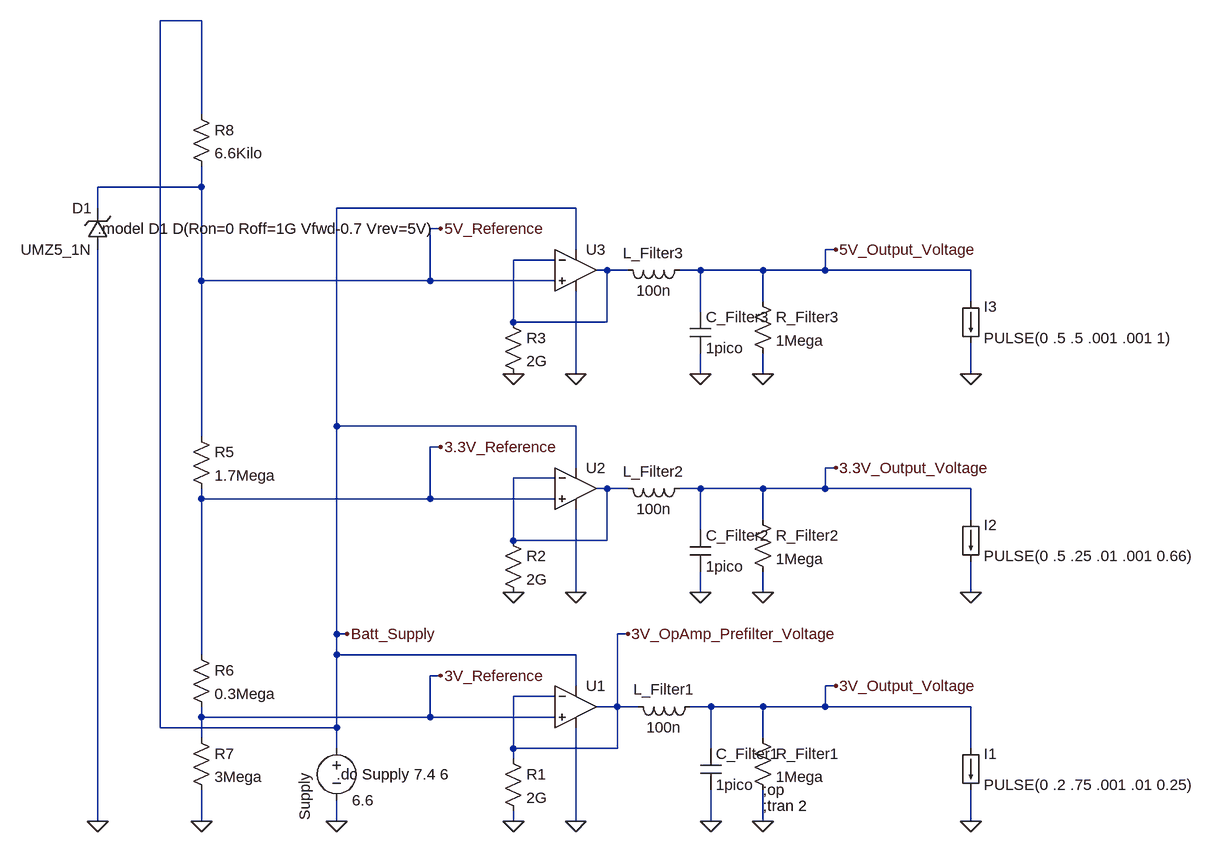
[diagram p0: schematic Cube Sat Power Supply.asc]
Cube Sat Power Supply.asc, the LTspice schematic file:
Version 4
SHEET 1 1560 680
WIRE 0 -992 -64 -992
WIRE 0 -848 0 -992
WIRE 0 -736 0 -768
WIRE 0 -736 -160 -736
WIRE -160 -704 -160 -736
WIRE 576 -704 208 -704
WIRE 368 -672 352 -672
WIRE 576 -640 576 -704
WIRE 976 -640 960 -640
WIRE 544 -624 480 -624
WIRE 624 -608 608 -608
WIRE 656 -608 624 -608
WIRE 768 -608 736 -608
WIRE 864 -608 768 -608
WIRE 960 -608 960 -640
WIRE 960 -608 864 -608
WIRE 1184 -608 960 -608
WIRE 0 -592 0 -736
WIRE 352 -592 352 -672
WIRE 352 -592 0 -592
WIRE 544 -592 352 -592
WIRE 864 -560 864 -608
WIRE 1184 -560 1184 -608
WIRE 768 -544 768 -608
WIRE 480 -528 480 -624
WIRE 624 -528 624 -608
WIRE 624 -528 480 -528
WIRE 576 -448 576 -576
WIRE 768 -448 768 -480
WIRE 864 -448 864 -480
WIRE 1184 -448 1184 -496
WIRE 208 -368 208 -704
WIRE 576 -368 208 -368
WIRE 0 -352 0 -592
WIRE 368 -336 352 -336
WIRE 576 -304 576 -368
WIRE 976 -304 960 -304
WIRE 544 -288 480 -288
WIRE 624 -272 608 -272
WIRE 656 -272 624 -272
WIRE 768 -272 736 -272
WIRE 864 -272 768 -272
WIRE 960 -272 960 -304
WIRE 960 -272 864 -272
WIRE 1184 -272 960 -272
WIRE 0 -256 0 -272
WIRE 352 -256 352 -336
WIRE 352 -256 0 -256
WIRE 544 -256 352 -256
WIRE 864 -224 864 -272
WIRE 1184 -224 1184 -272
WIRE 768 -208 768 -272
WIRE 480 -192 480 -288
WIRE 624 -192 624 -272
WIRE 624 -192 480 -192
WIRE 576 -112 576 -240
WIRE 768 -112 768 -144
WIRE 864 -112 864 -144
WIRE 1184 -112 1184 -160
WIRE 208 -48 208 -368
WIRE 224 -48 208 -48
WIRE 656 -48 640 -48
WIRE 0 -16 0 -256
WIRE 208 -16 208 -48
WIRE 576 -16 208 -16
WIRE 368 16 352 16
WIRE 576 32 576 -16
WIRE 976 32 960 32
WIRE 544 48 480 48
WIRE 640 64 640 -48
WIRE 640 64 608 64
WIRE 672 64 640 64
WIRE 784 64 752 64
WIRE 864 64 784 64
WIRE 960 64 960 32
WIRE 960 64 864 64
WIRE 1184 64 960 64
WIRE 0 80 0 64
WIRE 352 80 352 16
WIRE 352 80 0 80
WIRE 544 80 352 80
WIRE -64 96 -64 -992
WIRE 208 96 208 -16
WIRE 208 96 -64 96
WIRE 0 112 0 80
WIRE 864 112 864 64
WIRE 208 128 208 96
WIRE 480 128 480 48
WIRE 640 128 640 64
WIRE 640 128 480 128
WIRE 784 128 784 64
WIRE 1184 128 1184 64
WIRE 480 144 480 128
WIRE -160 240 -160 -640
WIRE 0 240 0 192
WIRE 208 240 208 208
WIRE 480 240 480 224
WIRE 576 240 576 96
WIRE 784 240 784 192
WIRE 864 240 864 192
WIRE 1184 240 1184 192
FLAG 208 240 0
FLAG 576 240 0
FLAG 480 240 0
FLAG 784 240 0
FLAG 864 240 0
FLAG 976 32 3V_Output_Voltage
FLAG 656 -48 3V_OpAmp_Prefilter_Voltage
FLAG 224 -48 Batt_Supply
FLAG 368 16 3V_Reference
FLAG 1184 240 0
FLAG 768 -448 0
FLAG 768 -112 0
FLAG 864 -112 0
FLAG 864 -448 0
FLAG 1184 -112 0
FLAG 1184 -448 0
FLAG 576 -448 0
FLAG 576 -112 0
FLAG 480 -448 0
FLAG 480 -112 0
FLAG 0 240 0
FLAG 368 -336 3.3V_Reference
FLAG 368 -672 5V_Reference
FLAG 976 -304 3.3V_Output_Voltage
FLAG 976 -640 5V_Output_Voltage
FLAG -160 240 0
SYMBOL voltage 208 112 R0
WINDOW 123 0 0 Left 0
WINDOW 39 0 0 Left 0
WINDOW 0 -49 127 VLeft 2
SYMATTR InstName Supply
SYMATTR Value 6.6
SYMBOL OpAmps\\UniversalOpAmp 576 64 R0
SYMATTR InstName U1
SYMBOL res 464 128 R0
SYMATTR InstName R1
SYMATTR Value 2G
SYMBOL ind 768 48 R90
WINDOW 0 5 56 VBottom 2
WINDOW 3 32 56 VTop 2
SYMATTR InstName L_Filter1
SYMATTR Value 100n
SYMBOL cap 768 128 R0
SYMATTR InstName C_Filter1
SYMATTR Value 1pico
SYMBOL res 848 96 R0
SYMATTR InstName R_Filter1
SYMATTR Value 1Mega
SYMBOL load 1168 128 R0
WINDOW 123 0 0 Left 0
WINDOW 39 0 0 Left 0
SYMATTR InstName I1
SYMATTR Value PULSE(0 .2 .75 .001 .01 0.25)
SYMBOL OpAmps\\UniversalOpAmp 576 -272 R0
SYMATTR InstName U2
SYMBOL OpAmps\\UniversalOpAmp 576 -608 R0
SYMATTR InstName U3
SYMBOL ind 752 -288 R90
WINDOW 0 5 56 VBottom 2
WINDOW 3 32 56 VTop 2
SYMATTR InstName L_Filter2
SYMATTR Value 100n
SYMBOL ind 752 -624 R90
WINDOW 0 5 56 VBottom 2
WINDOW 3 32 56 VTop 2
SYMATTR InstName L_Filter3
SYMATTR Value 100n
SYMBOL cap 752 -208 R0
SYMATTR InstName C_Filter2
SYMATTR Value 1pico
SYMBOL cap 752 -544 R0
SYMATTR InstName C_Filter3
SYMATTR Value 1pico
SYMBOL res 848 -576 R0
SYMATTR InstName R_Filter3
SYMATTR Value 1Mega
SYMBOL res 848 -240 R0
SYMATTR InstName R_Filter2
SYMATTR Value 1Mega
SYMBOL load 1168 -224 R0
WINDOW 123 0 0 Left 0
WINDOW 39 0 0 Left 0
SYMATTR InstName I2
SYMATTR Value PULSE(0 .5 .25 .01 .001 0.66)
SYMBOL load 1168 -560 R0
WINDOW 123 0 0 Left 0
WINDOW 39 0 0 Left 0
SYMATTR InstName I3
SYMATTR Value PULSE(0 .5 .5 .001 .001 1)
SYMBOL res 464 -208 R0
SYMATTR InstName R2
SYMATTR Value 2G
SYMBOL res 464 -544 R0
SYMATTR InstName R3
SYMATTR Value 2G
SYMBOL res -16 -368 R0
SYMATTR InstName R5
SYMATTR Value 1.7Mega
SYMBOL res -16 -32 R0
SYMATTR InstName R6
SYMATTR Value 0.3Mega
SYMBOL res -16 96 R0
SYMATTR InstName R7
SYMATTR Value 3Mega
SYMBOL res -16 -864 R0
SYMATTR InstName R8
SYMATTR Value 6.6Kilo
SYMBOL zener -144 -640 R180
WINDOW 0 24 64 Left 2
WINDOW 3 24 0 Left 2
SYMATTR InstName D1
SYMATTR Value UMZ5_1N
TEXT 864 192 Left 2 !;op
TEXT 864 216 Left 2 !;tran 2
TEXT -160 -672 Left 2 !.model D1 D(Ron=0 Roff=1G Vfwd-0.7 Vrev=5V)
TEXT 208 168 Left 2 !.dc Supply 7.4 6

The netlist it stands for:
* Cube Sat Power Supply.asc
V§Supply Batt_Supply 0 6.6
XU1 3V_Reference 3V_OpAmp_Prefilter_Voltage Batt_Supply 0 3V_OpAmp_Prefilter_Voltage level1 Avol=1Meg GBW=10Meg Vos=0 En=0 Enk=0 In=0 Ink=0 Rin=500Meg  ; pins In+ In- V+ V- OUT
R1 3V_OpAmp_Prefilter_Voltage 0 2G
L_Filter1 3V_Output_Voltage 3V_OpAmp_Prefilter_Voltage 100n
C_Filter1 3V_Output_Voltage 0 1pico
R_Filter1 3V_Output_Voltage 0 1Mega
I1 3V_Output_Voltage 0 PULSE(0 .2 .75 .001 .01 0.25)
XU2 3.3V_Reference N002 Batt_Supply 0 N002 level1 Avol=1Meg GBW=10Meg Vos=0 En=0 Enk=0 In=0 Ink=0 Rin=500Meg  ; pins In+ In- V+ V- OUT
XU3 5V_Reference N001 Batt_Supply 0 N001 level1 Avol=1Meg GBW=10Meg Vos=0 En=0 Enk=0 In=0 Ink=0 Rin=500Meg  ; pins In+ In- V+ V- OUT
L_Filter2 3.3V_Output_Voltage N002 100n
L_Filter3 5V_Output_Voltage N001 100n
C_Filter2 3.3V_Output_Voltage 0 1pico
C_Filter3 5V_Output_Voltage 0 1pico
R_Filter3 5V_Output_Voltage 0 1Mega
R_Filter2 3.3V_Output_Voltage 0 1Mega
I2 3.3V_Output_Voltage 0 PULSE(0 .5 .25 .01 .001 0.66)
I3 5V_Output_Voltage 0 PULSE(0 .5 .5 .001 .001 1)
R2 N002 0 2G
R3 N001 0 2G
R5 5V_Reference 3.3V_Reference 1.7Mega
R6 3.3V_Reference 3V_Reference 0.3Mega
R7 3V_Reference 0 3Mega
R8 Batt_Supply 5V_Reference 6.6Kilo
D1 0 5V_Reference UMZ5_1N
.model D D
.lib standard.dio
;op
;tran 2
.model D1 D(Ron=0 Roff=1G Vfwd-0.7 Vrev=5V)
.dc Supply 7.4 6
.lib UniversalOpAmp1.lib
.backanno
.end